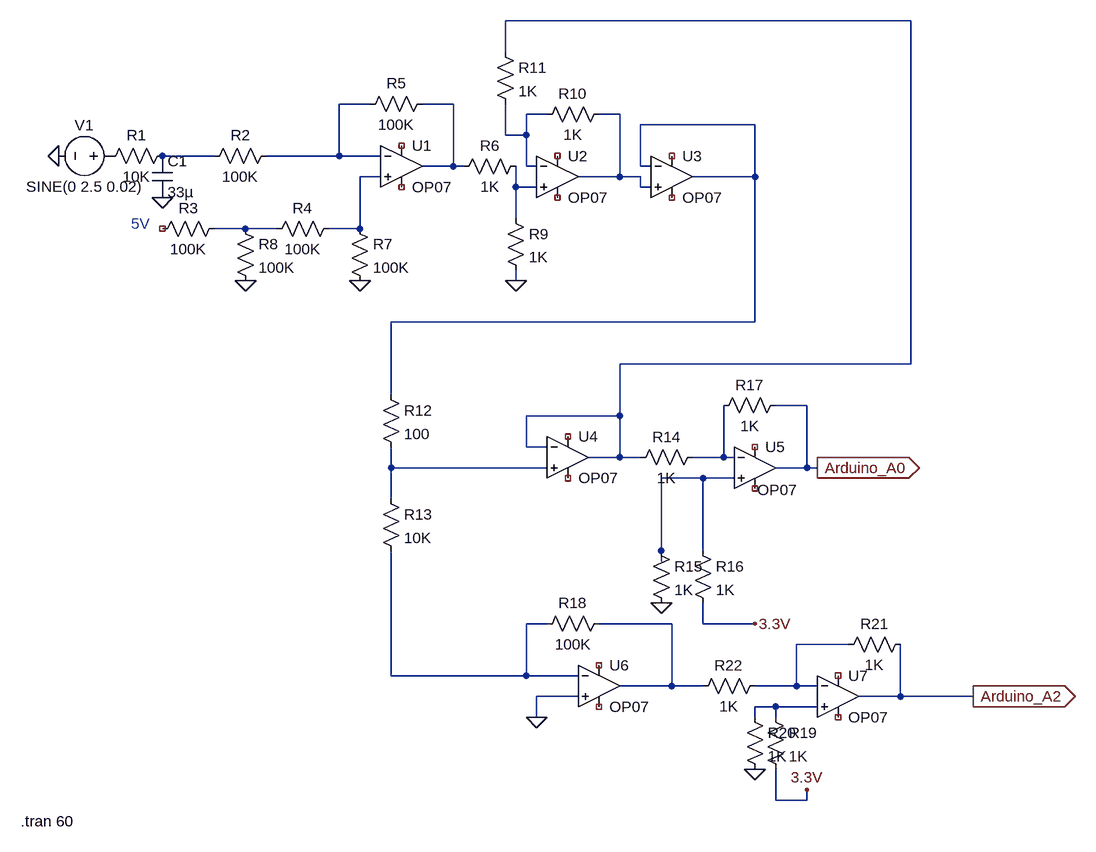
[diagram p0: schematic circuit2.asc]
circuit2.asc, the LTspice schematic file:
Version 4
SHEET 1 1684 1384
WIRE 1392 -80 768 -80
WIRE 768 -32 768 -80
WIRE 560 48 512 48
WIRE 688 48 640 48
WIRE 832 64 800 64
WIRE 944 64 912 64
WIRE 1152 80 976 80
WIRE 768 96 768 48
WIRE 800 96 800 64
WIRE 800 96 768 96
WIRE 320 128 240 128
WIRE 512 128 512 48
WIRE 512 128 400 128
WIRE 576 128 512 128
WIRE 688 144 688 48
WIRE 688 144 640 144
WIRE 704 144 688 144
WIRE 800 144 800 96
WIRE 816 144 800 144
WIRE 976 144 976 80
WIRE 992 144 976 144
WIRE 576 160 544 160
WIRE 944 160 944 64
WIRE 944 160 880 160
WIRE 976 160 944 160
WIRE 1152 160 1152 80
WIRE 1152 160 1056 160
WIRE 784 176 784 144
WIRE 816 176 784 176
WIRE 976 176 976 160
WIRE 992 176 976 176
WIRE 784 224 784 176
WIRE 368 240 320 240
WIRE 416 240 368 240
WIRE 544 240 544 160
WIRE 544 240 496 240
WIRE 784 320 784 304
WIRE 1152 384 1152 160
WIRE 1152 384 592 384
WIRE 1392 448 1392 -80
WIRE 1392 448 944 448
WIRE 592 496 592 384
WIRE 1232 512 1184 512
WIRE 944 528 944 448
WIRE 944 528 800 528
WIRE 800 576 800 528
WIRE 832 576 800 576
WIRE 944 592 944 528
WIRE 944 592 896 592
WIRE 976 592 944 592
WIRE 1104 592 1104 512
WIRE 1104 592 1056 592
WIRE 1120 592 1104 592
WIRE 592 608 592 576
WIRE 832 608 592 608
WIRE 1232 608 1232 512
WIRE 1232 608 1184 608
WIRE 1248 608 1232 608
WIRE 1072 624 1008 624
WIRE 1120 624 1072 624
WIRE 592 656 592 608
WIRE 1008 736 1008 624
WIRE 1072 736 1072 624
WIRE 1008 752 1008 736
WIRE 832 848 800 848
WIRE 1024 848 912 848
WIRE 1072 848 1072 816
WIRE 1152 848 1072 848
WIRE 1296 880 1216 880
WIRE 592 928 592 736
WIRE 800 928 800 848
WIRE 800 928 592 928
WIRE 880 928 800 928
WIRE 1024 944 1024 848
WIRE 1024 944 944 944
WIRE 1072 944 1024 944
WIRE 1216 944 1216 880
WIRE 1216 944 1152 944
WIRE 1248 944 1216 944
WIRE 880 960 816 960
WIRE 1376 960 1376 880
WIRE 1376 960 1312 960
WIRE 1488 960 1376 960
WIRE 1184 976 1152 976
WIRE 1248 976 1184 976
WIRE 816 992 816 960
WIRE 1152 992 1152 976
WIRE 1184 992 1184 976
WIRE 1184 1120 1184 1072
WIRE 1232 1120 1232 1104
WIRE 1232 1120 1184 1120
FLAG 368 320 0
FLAG 544 320 0
FLAG 240 192 0
FLAG 784 320 0
FLAG 1248 608 Arduino_A0
IOPIN 1248 608 Out
FLAG 1008 816 0
FLAG 1152 848 3.3V
FLAG 816 992 0
FLAG 1488 960 Arduino_A2
IOPIN 1488 960 Out
FLAG 1152 1072 0
FLAG 1232 1104 3.3V
FLAG 80 128 0
SYMBOL res 256 112 R90
WINDOW 0 0 56 VBottom 2
WINDOW 3 32 56 VTop 2
SYMATTR InstName R1
SYMATTR Value 10K
SYMBOL res 416 112 R90
WINDOW 0 0 56 VBottom 2
WINDOW 3 32 56 VTop 2
SYMATTR InstName R2
SYMATTR Value 100K
SYMBOL res 336 224 R90
WINDOW 0 0 56 VBottom 2
WINDOW 3 32 56 VTop 2
SYMATTR InstName R3
SYMATTR Value 100K
SYMBOL res 512 224 R90
WINDOW 0 0 56 VBottom 2
WINDOW 3 32 56 VTop 2
SYMATTR InstName R4
SYMATTR Value 100K
SYMBOL res 656 32 R90
WINDOW 0 0 56 VBottom 2
WINDOW 3 32 56 VTop 2
SYMATTR InstName R5
SYMATTR Value 100K
SYMBOL res 800 128 R90
WINDOW 0 0 56 VBottom 2
WINDOW 3 32 56 VTop 2
SYMATTR InstName R6
SYMATTR Value 1K
SYMBOL OpAmps\\OP07 608 80 R0
SYMATTR InstName U1
SYMBOL res 528 224 R0
SYMATTR InstName R7
SYMATTR Value 100K
SYMBOL res 352 224 R0
SYMATTR InstName R8
SYMATTR Value 100K
SYMBOL cap 224 128 R0
SYMATTR InstName C1
SYMATTR Value 33µ
SYMBOL OpAmps\\OP07 848 96 R0
SYMATTR InstName U2
SYMBOL OpAmps\\OP07 1024 96 R0
SYMATTR InstName U3
SYMBOL OpAmps\\OP07 864 528 R0
SYMATTR InstName U4
SYMBOL OpAmps\\OP07 1152 544 R0
WINDOW 3 4 98 Left 2
SYMATTR InstName U5
SYMBOL OpAmps\\OP07 912 880 R0
SYMATTR InstName U6
SYMBOL OpAmps\\OP07 1280 896 R0
SYMATTR InstName U7
SYMBOL res 768 208 R0
SYMATTR InstName R9
SYMATTR Value 1K
SYMBOL res 928 48 R90
WINDOW 0 0 56 VBottom 2
WINDOW 3 32 56 VTop 2
SYMATTR InstName R10
SYMATTR Value 1K
SYMBOL res 752 -48 R0
SYMATTR InstName R11
SYMATTR Value 1K
SYMBOL res 576 480 R0
SYMATTR InstName R12
SYMATTR Value 100
SYMBOL res 576 640 R0
SYMATTR InstName R13
SYMATTR Value 10K
SYMBOL res 1072 576 R90
WINDOW 0 0 56 VBottom 2
WINDOW 3 32 56 VTop 2
SYMATTR InstName R14
SYMATTR Value 1K
SYMBOL res 992 720 R0
SYMATTR InstName R15
SYMATTR Value 1K
SYMBOL res 1056 720 R0
SYMATTR InstName R16
SYMATTR Value 1K
SYMBOL res 1200 496 R90
WINDOW 0 0 56 VBottom 2
WINDOW 3 32 56 VTop 2
SYMATTR InstName R17
SYMATTR Value 1K
SYMBOL res 928 832 R90
WINDOW 0 0 56 VBottom 2
WINDOW 3 32 56 VTop 2
SYMATTR InstName R18
SYMATTR Value 100K
SYMBOL res 1168 976 R0
SYMATTR InstName R19
SYMATTR Value 1K
SYMBOL res 1136 976 R0
SYMATTR InstName R20
SYMATTR Value 1K
SYMBOL res 1392 864 R90
WINDOW 0 0 56 VBottom 2
WINDOW 3 32 56 VTop 2
SYMATTR InstName R21
SYMATTR Value 1K
SYMBOL res 1168 928 R90
WINDOW 0 0 56 VBottom 2
WINDOW 3 32 56 VTop 2
SYMATTR InstName R22
SYMATTR Value 1K
SYMBOL voltage 176 128 R90
WINDOW 0 -32 56 VBottom 2
WINDOW 3 32 56 VTop 2
WINDOW 123 0 0 Left 0
WINDOW 39 0 0 Left 0
SYMATTR InstName V1
SYMATTR Value SINE(0 2.5 0.02)
TEXT 192 232 Left 2 ;5V
TEXT 22 1152 Left 2 !.tran 60

The netlist it stands for:
* circuit2.asc
R1 N007 P001 10K
R2 N002 N007 100K
R3 N010 NC_01 100K
R4 N008 N010 100K
R5 N003 N002 100K
R6 N009 N003 1K
XU1 N008 N002 NC_02 NC_03 N003 LT1001  ; OP07, pins In+ In- V+ V- OUT
R7 N008 0 100K
R8 N010 0 100K
C1 N007 0 33µ
XU2 N009 N004 NC_04 NC_05 N005 LT1001  ; OP07, pins In+ In- V+ V- OUT
XU3 N005 N006 NC_06 NC_07 N006 LT1001  ; OP07, pins In+ In- V+ V- OUT
XU4 N012 N001 NC_08 NC_09 N001 LT1001  ; OP07, pins In+ In- V+ V- OUT
XU5 N013 N011 NC_10 NC_11 Arduino_A0 LT1001  ; OP07, pins In+ In- V+ V- OUT
XU6 0 N014 NC_12 NC_13 N015 LT1001  ; OP07, pins In+ In- V+ V- OUT
XU7 N017 N016 NC_14 NC_15 Arduino_A2 LT1001  ; OP07, pins In+ In- V+ V- OUT
R9 N009 0 1K
R10 N005 N004 1K
R11 N001 N004 1K
R12 N006 N012 100
R13 N012 N014 10K
R14 N011 N001 1K
R15 N013 0 1K
R16 N013 3.3V 1K
R17 Arduino_A0 N011 1K
R18 N015 N014 100K
R19 N017 3.3V 1K
R20 N017 0 1K
R21 Arduino_A2 N016 1K
R22 N016 N015 1K
V1 P001 0 SINE(0 2.5 0.02)
* 5V
.tran 60
.lib LTC.lib
.backanno
.end